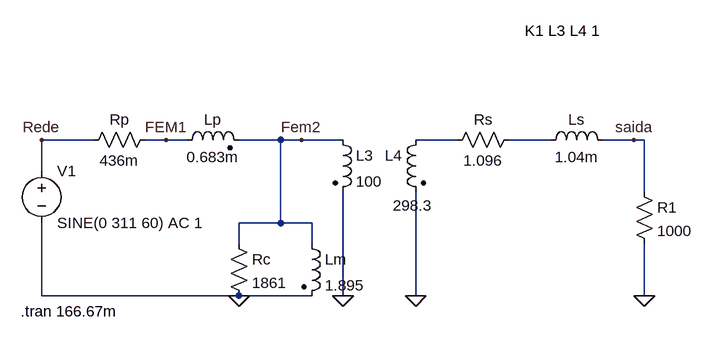
[diagram p0: schematic ex2_transformador.asc]
ex2_transformador.asc, the LTspice schematic file:
Version 4
SHEET 1 1336 680
WIRE -336 0 -416 0
WIRE -224 0 -256 0
WIRE -192 0 -224 0
WIRE -48 0 -112 0
WIRE -16 0 -48 0
WIRE 48 0 -16 0
WIRE 224 0 160 0
WIRE 368 0 304 0
WIRE 496 0 448 0
WIRE 512 0 496 0
WIRE -416 48 -416 0
WIRE 512 80 512 0
WIRE -48 128 -48 0
WIRE -48 128 -112 128
WIRE 0 128 -48 128
WIRE -112 160 -112 128
WIRE 0 160 0 128
WIRE -416 240 -416 128
WIRE -112 240 -416 240
WIRE 0 240 -112 240
WIRE 48 240 48 80
WIRE 160 240 160 80
WIRE 512 240 512 160
FLAG -112 240 0
FLAG 48 240 0
FLAG 160 240 0
FLAG -416 0 Rede
FLAG 496 0 saida
FLAG -224 0 FEM1
FLAG -16 0 Fem2
FLAG 512 240 0
SYMBOL voltage -416 32 R0
SYMATTR InstName V1
SYMATTR Value SINE(0 311 60) AC 1
SYMBOL res -240 -16 R90
WINDOW 0 0 56 VBottom 2
WINDOW 3 32 56 VTop 2
SYMATTR InstName Rp
SYMATTR Value 436m
SYMBOL ind2 -208 16 R270
WINDOW 0 32 56 VTop 2
WINDOW 3 5 56 VBottom 2
SYMATTR InstName Lp
SYMATTR Value 0.683m
SYMATTR Type ind
SYMBOL res -128 144 R0
SYMATTR InstName Rc
SYMATTR Value 1861
SYMBOL ind2 -16 144 R0
SYMATTR InstName Lm
SYMATTR Value 1.895
SYMATTR Type ind
SYMBOL ind2 32 -16 R0
SYMATTR InstName L3
SYMATTR Value 100
SYMATTR Type ind
SYMBOL ind2 176 -16 M0
WINDOW 3 -10 117 Left 2
SYMATTR Value 298.3
SYMATTR InstName L4
SYMATTR Type ind
SYMBOL res 320 -16 R90
WINDOW 0 0 56 VBottom 2
WINDOW 3 32 56 VTop 2
SYMATTR InstName Rs
SYMATTR Value 1.096
SYMBOL ind 352 16 R270
WINDOW 0 32 56 VTop 2
WINDOW 3 5 56 VBottom 2
SYMATTR InstName Ls
SYMATTR Value 1.04m
SYMBOL res 496 64 R0
SYMATTR InstName R1
SYMATTR Value 1000
TEXT 328 -168 Left 2 !K1 L3 L4 1
TEXT -448 264 Left 2 !.tran 166.67m

The netlist it stands for:
* ex2_transformador.asc
V1 Rede 0 SINE(0 311 60) AC 1
Rp FEM1 Rede 436m
Lp FEM1 Fem2 0.683m
Rc Fem2 0 1861
Lm Fem2 0 1.895
L3 Fem2 0 100
L4 N001 0 298.3
Rs N002 N001 1.096
Ls N002 saida 1.04m
R1 saida 0 1000
K1 L3 L4 1
.tran 166.67m
.backanno
.end